# Altium schematic sheet Vibration-Motor.SchDoc
size A; SheetNumber: 8; SheetTotal: 15
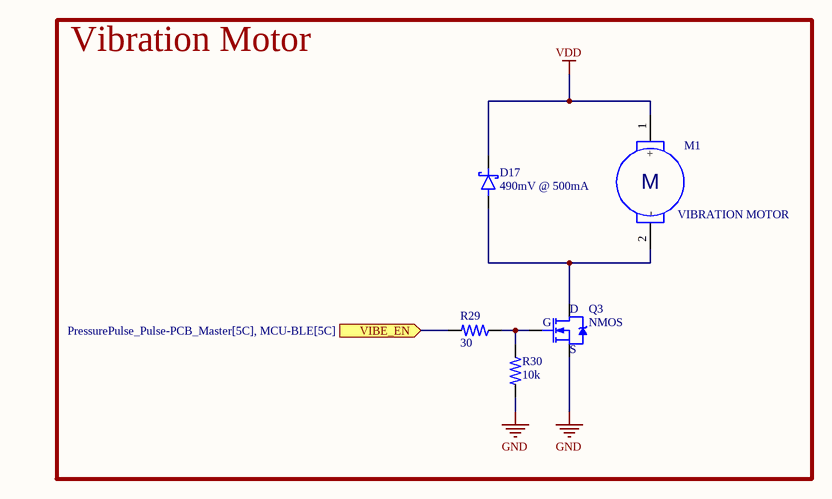
[diagram p0: Vibration-Motor.SchDoc]

## Parts
D17  490mV @ 500mA  [SOD-523]
M1  VIBRATION MOTOR  [BARE PADS - 2]
Q3  NMOS  [SOT-23]
R29  value 30  [0402R]  (hidden comment: RES)
R30  value 10k  [0402R]  (hidden comment: RES)

## Blocks framed on the sheet
Vibration Motor: D17 M1 Q3 R29 R30

## Ports
VIBE_EN (in, see PressurePulse_Pulse-PCB_Master[5C], MCU-BLE[5C])

## Nets
GND: Q3.S R30.2
VDD: D17.K M1.1(+)
VIBE_EN: R29.2 ; port VIBE_EN
NetD17_A: D17.A M1.2(-) Q3.D
NetQ3_G: Q3.G R29.1 R30.1

## Notes on the sheet
- (in symbol VIBRATION MOTOR) M

## Library data of the parts
D17 = SCHOTTKY DIODE: MFR: Shikues; MFR PN: MSK4005; Value: MSK4005; JLCPCB PN: C345957
M1 = VIBRATION MOTOR: 9000rpm Coin Type Vibration Motor 3V -  Vibration Motor ROHS; MFR: LEADER; MFR PN: LCM0827A3038F; Value: LCM0827A3038F; JLCPCB PN: C2759981
Q3 = NMOS: 100V 1.6A 1.3W 220mΩ@10V,1.6A N Channel SOT-23  MOSFETs ROHS; MFR: Infineon; Value: IRLML0100TRPBF; MFR PN: IRLML0100TRPBF; JLCPCB PN: C53658
R29 R30 = RES: Resistor; MFR PN: *; MFR: *; JLCPCB PN: *